# EasyEDA schematic EasyEDA-wega-mixer.json
TITLE: Sheet_1; REV: 1.0; Date: 2020-11-25; Sheet: 1/1; Drawn By: siv237; Company: Your Company
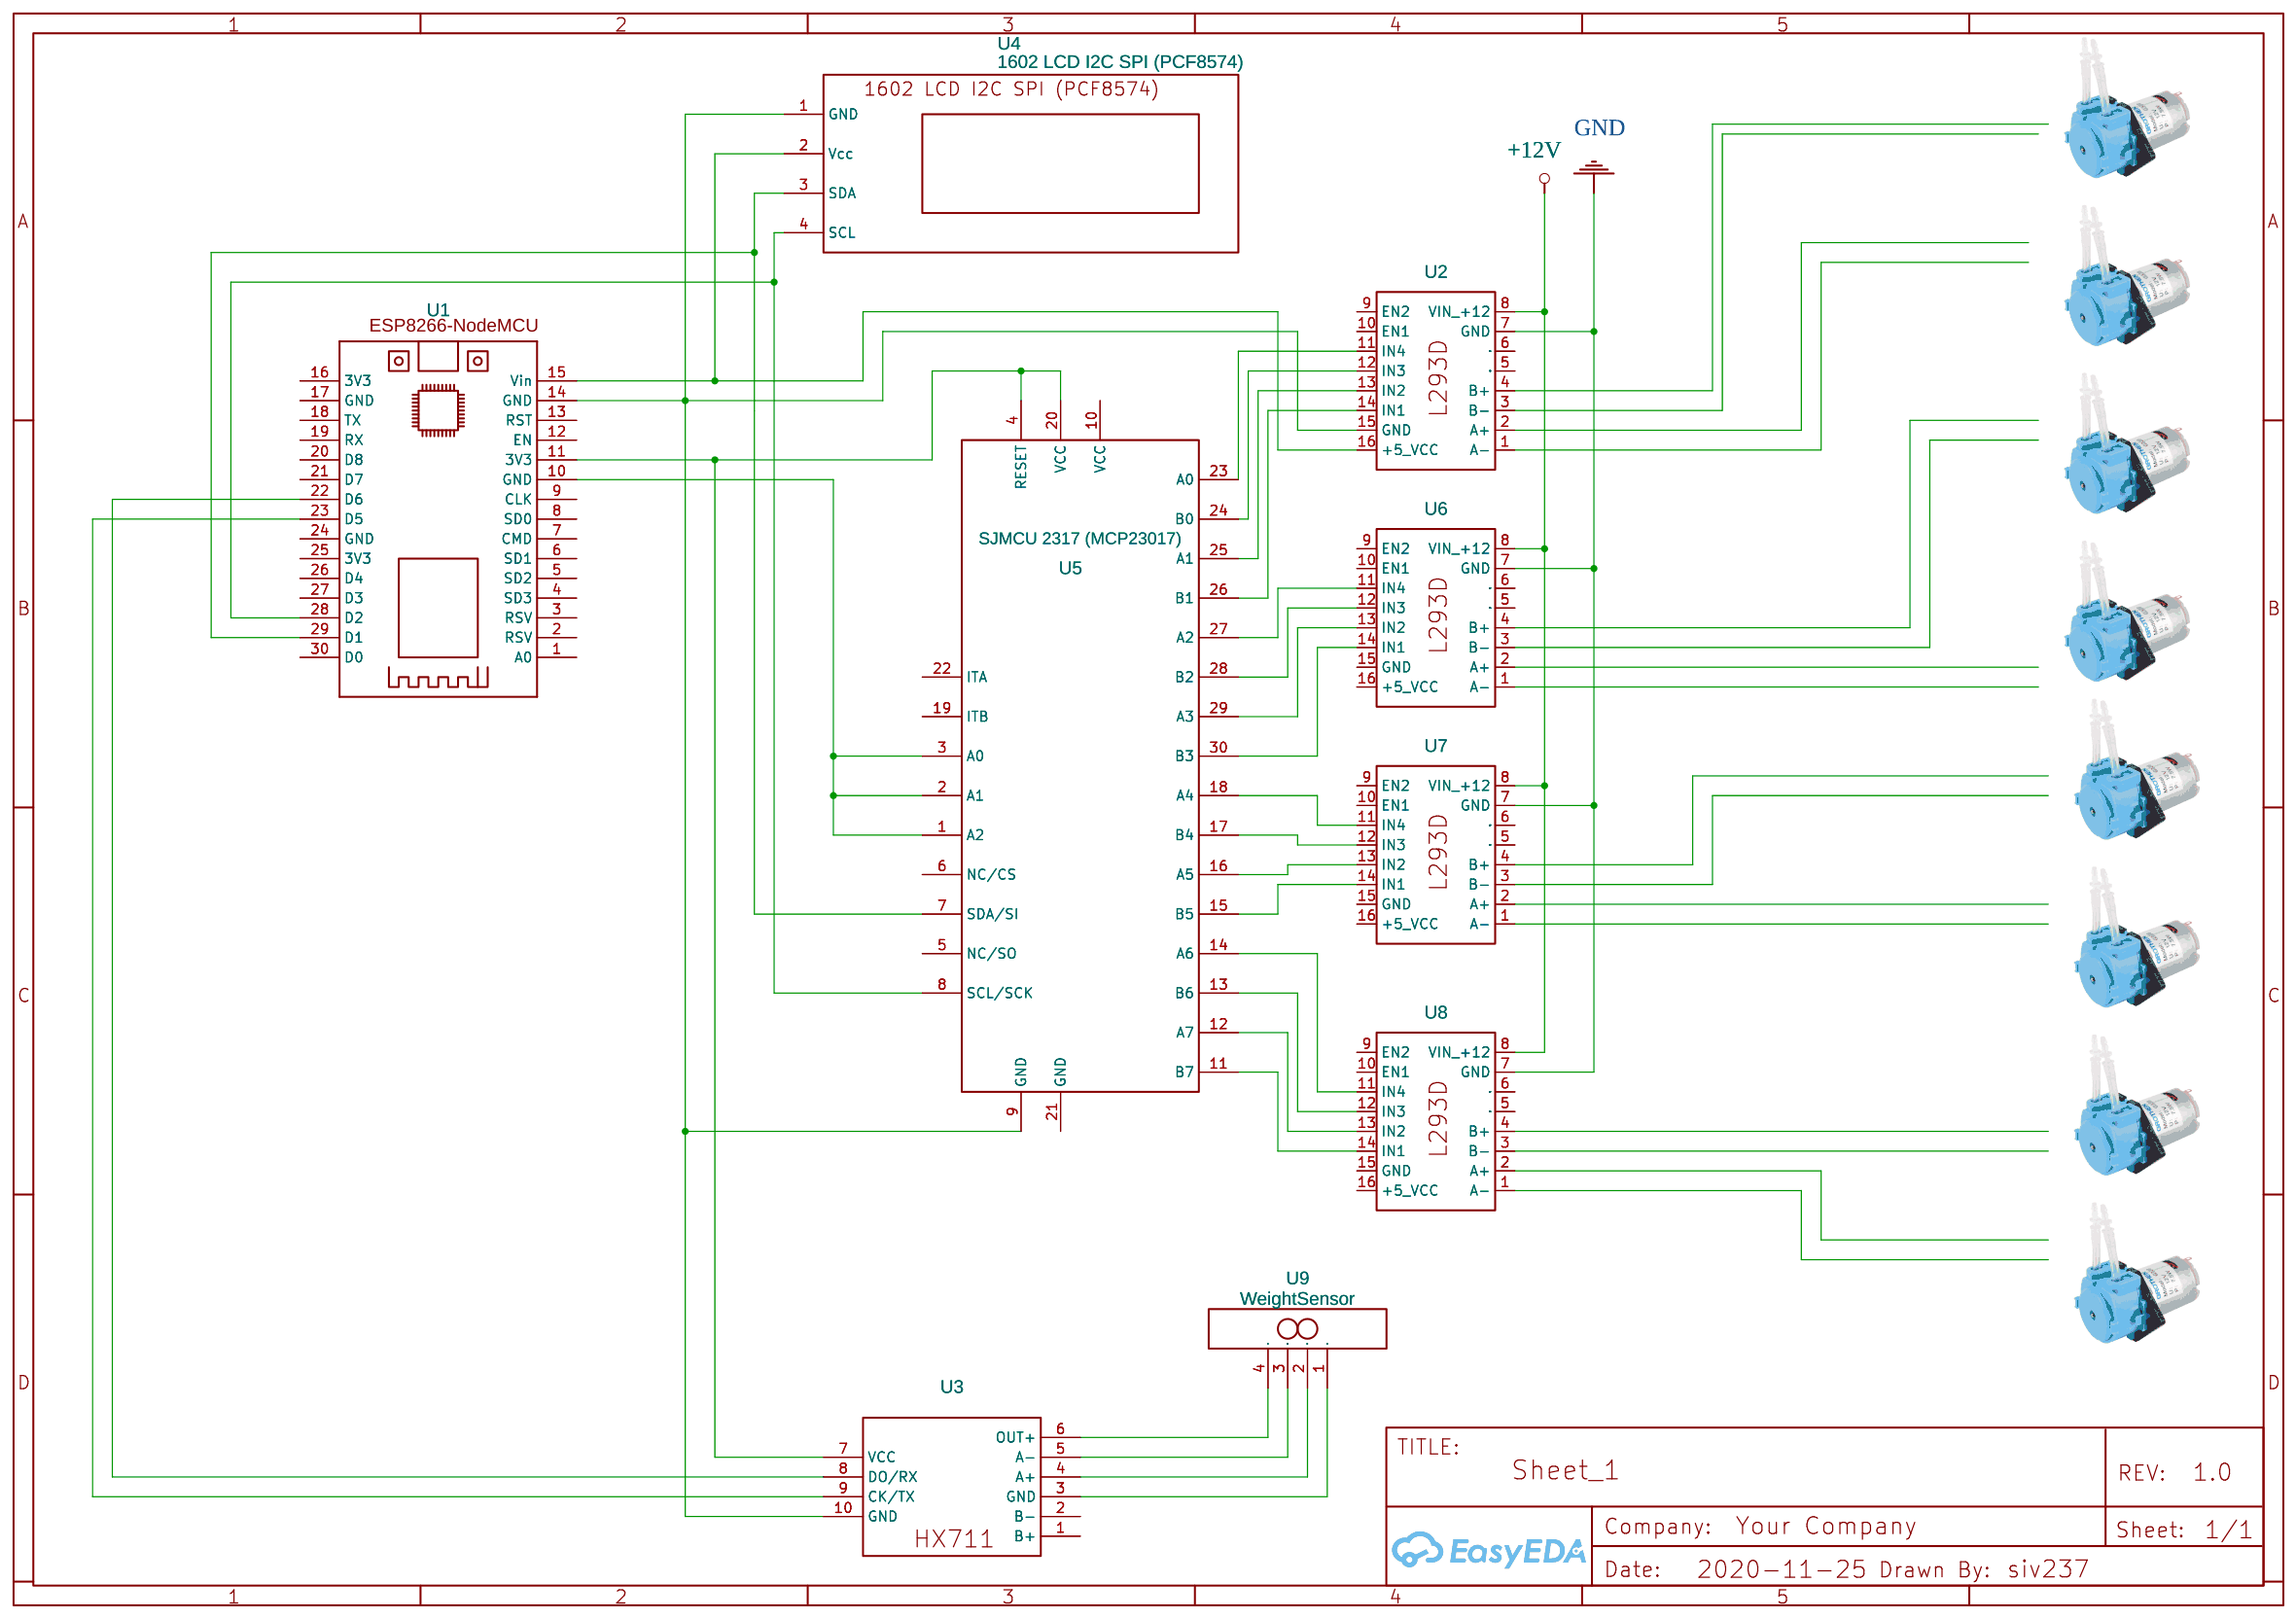
[diagram p0: schematic sheet]

## Parts
U1  ESP8266 NodeMCU  [ESP8266 NODEMCU]
U2  L293D  [L293D]
U3  HX711  [XFW-HX711]
U4  1602 LCD I2C SPI (PCF8574)  [1602 LCD I2C SPI]
U5  SJMCU 2317 (MCP23017)  [MCP23S17 MODULE]
U6  L293D  [L293D]
U7  L293D  [L293D]
U8  L293D  [L293D]
U9  WeightSensor

## Library data of the parts
U1 = ESP8266 NodeMCU: Contributor: carlos14
U2 U6-U8 = L293D: Contributor: SWC_PCB
U3 = HX711: Contributor: Lberquez
U4 = 1602 LCD I2C SPI (PCF8574): Contributor: Юрий Владимирович (Duck Duck)
U5 = MCP23S17 Module: Contributor: GilgaFrank
U9 = WeightSensor: Manufacturer Part: New SchematicLib; Contributor: martinfleurial

## Nets
+12V: U2.8(VIN +12) U6.8(VIN +12) U7.8(VIN +12) U8.8(VIN +12)
GND: U2.7(GND) U6.7(GND) U7.7(GND) U8.7(GND)
Net-(U1-10): U1.10(GND) U5.1(A2) U5.2(A1) U5.3(A0)
Net-(U1-11): U1.11(3V3) U3.7(VCC) U5.4(RESET) U5.20(VCC)
Net-(U1-14): U1.14(GND) U2.15(GND) U3.10(GND) U4.1(GND) U5.9(GND)
Net-(U1-15): U1.15(Vin) U2.16(+5 VCC) U4.2(Vcc)
Net-(U1-22): U1.22(D6) U3.8(DO/RX)
Net-(U1-23): U1.23(D5) U3.9(CK/TX)
Net-(U1-28): U1.28(D2) U4.4(SCL) U5.8(SCL/SCK)
Net-(U1-29): U1.29(D1) U4.3(SDA) U5.7(SDA/SI)
Net-(U2-11): U2.11(IN4) U5.23(A0)
Net-(U2-12): U2.12(IN3) U5.24(B0)
Net-(U2-13): U2.13(IN2) U5.25(A1)
Net-(U2-14): U2.14(IN1) U5.26(B1)
Net-(U3-3): U3.3(GND) U9.1
Net-(U3-4): U3.4(A+) U9.2
Net-(U3-5): U3.5(A-) U9.3
Net-(U3-6): U3.6(OUT+) U9.4
Net-(U5-11): U5.11(B7) U8.14(IN1)
Net-(U5-12): U5.12(A7) U8.13(IN2)
Net-(U5-13): U5.13(B6) U8.12(IN3)
Net-(U5-14): U5.14(A6) U8.11(IN4)
Net-(U5-15): U5.15(B5) U7.14(IN1)
Net-(U5-16): U5.16(A5) U7.13(IN2)
Net-(U5-17): U5.17(B4) U7.12(IN3)
Net-(U5-18): U5.18(A4) U7.11(IN4)
Net-(U5-27): U5.27(A2) U6.11(IN4)
Net-(U5-28): U5.28(B2) U6.12(IN3)
Net-(U5-29): U5.29(A3) U6.13(IN2)
Net-(U5-30): U5.30(B3) U6.14(IN1)

Not connected (* = marked no-connect by the designer): U1 1(A0) 2(RSV) 3(RSV) 4(SD3) 5(SD2) 6(SD1) 7(CMD) 8(SD0) 9(CLK) 12(EN) 13(RST) 16(3V3) 17(GND) 18(TX) 19(RX) 20(D8) 21(D7) 24(GND) 25(3V3) 26(D4) 27(D3) 30(D0); U2 1(A-) 2(A+) 3(B-) 4(B+) 5(GND) 6(OUT2) 9(EN2) 10(EN1); U3 1(B+) 2(B-); U5 5(NC/SO) 6(NC/CS) 10(VCC) 19(ITB) 21(GND) 22(ITA); U6 1(A-) 2(A+) 3(B-) 4(B+) 5(GND) 6(OUT2) 9(EN2) 10(EN1) 15(GND) 16(+5 VCC); U7 1(A-) 2(A+) 3(B-) 4(B+) 5(GND) 6(OUT2) 9(EN2) 10(EN1) 15(GND) 16(+5 VCC); U8 1(A-) 2(A+) 3(B-) 4(B+) 5(GND) 6(OUT2) 9(EN2) 10(EN1) 15(GND) 16(+5 VCC)
